# Altium schematic sheet Sheet1.SchDoc
size A3
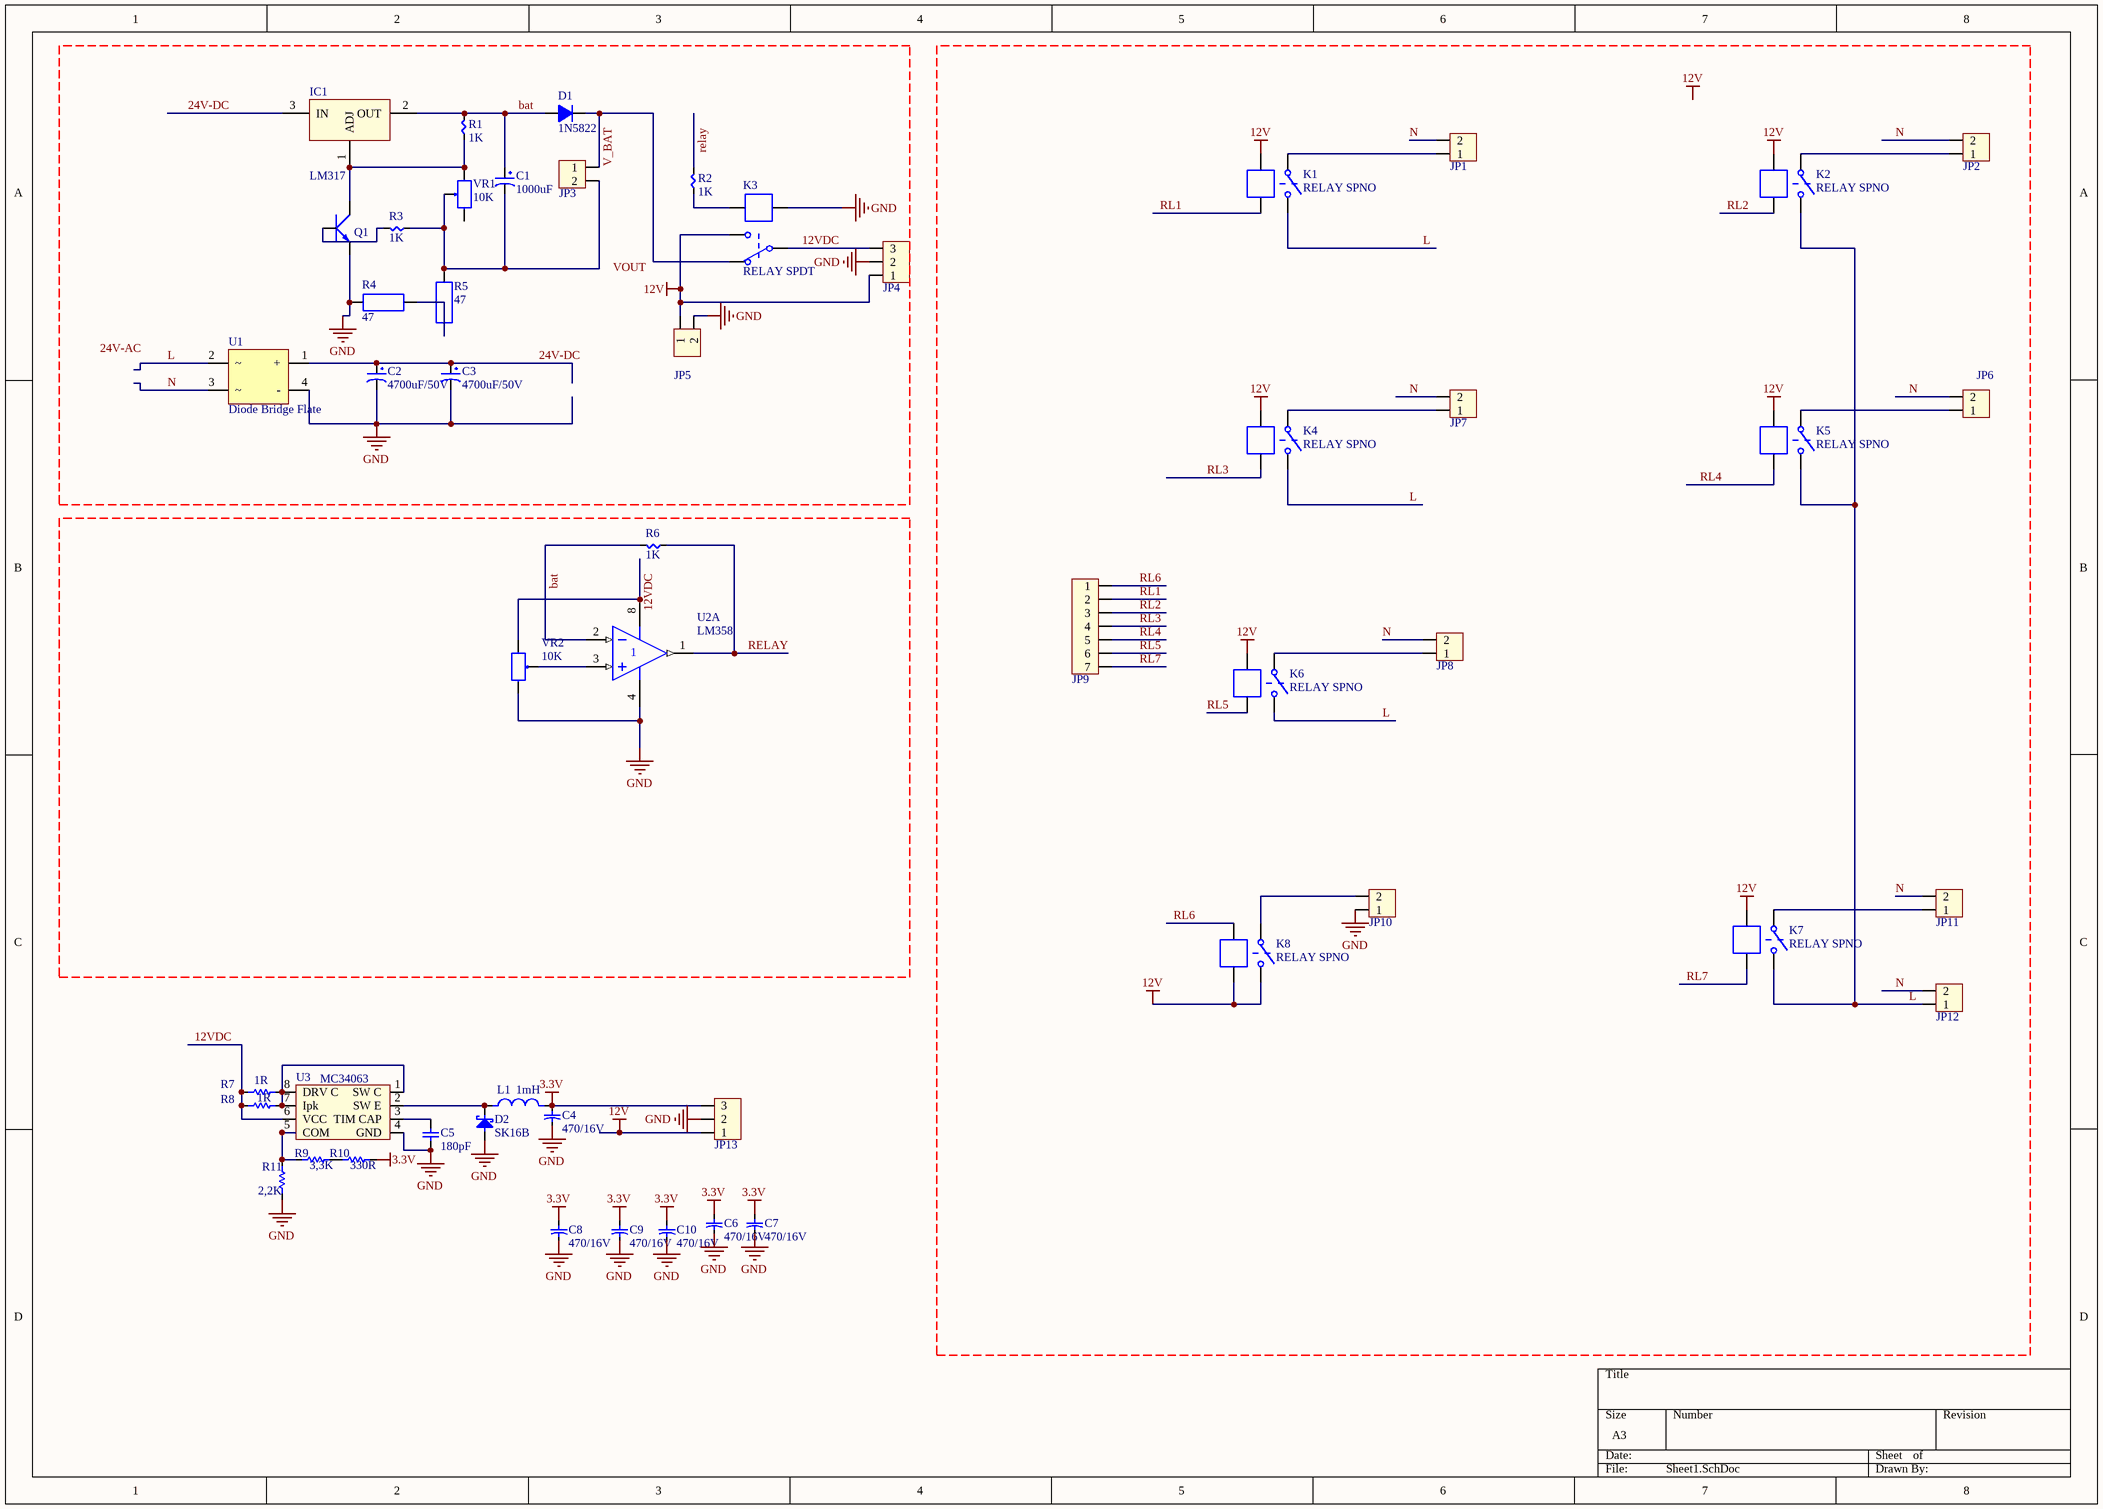
[diagram p0: Sheet1.SchDoc]

## Parts
C1  1000uF  [CP2/4]
C2  4700uF/50V  [CP2/4]
C3  4700uF/50V  [CP2/4]
C4  470/16V  [CAP 470/16V]
C5  180pF  [CAP 0805]
C6  470/16V  [CAP 470/16V]
C7  470/16V  [CAP 470/16V]
C8  470/16V  [CAP 470/16V]
C9  470/16V  [CAP 470/16V]
C10  470/16V  [CAP 470/16V]
D1  1N5822  [D5A]
D2  SK16B  [DIODE]
IC1  LM317  [QTO-220]
JP1  Connector 2  [HED2T]  (value not drawn)
JP2  Connector 2  [HED2T]  (value not drawn)
JP3  Connector 2  [HED2T]  (value not drawn)
JP4  Connector 3  [CON3]  (value not drawn)
JP5  Connector 2  [CON2]  (value not drawn)
JP6  Connector 2  [HED2T]  (value not drawn)
JP7  Connector 2  [HED2T]  (value not drawn)
JP8  Connector 2  [HED2T]  (value not drawn)
JP9  Connector 7  [CON7]  (value not drawn)
JP10  Connector 2  [HED2T]  (value not drawn)
JP11  Connector 2  [HED2T]  (value not drawn)
JP12  Connector 2  [HED2T]  (value not drawn)
JP13  Connector 3  [CON3]  (value not drawn)
K1  RELAY SPNO  [RELAY SONGCHUAN 834]
K2  RELAY SPNO  [RELAY SONGCHUAN 834]
K3  RELAY SPDT  [RELAY SPDT]
K4  RELAY SPNO  [RELAY SONGCHUAN 834]
K5  RELAY SPNO  [RELAY SONGCHUAN 834]
K6  RELAY SPNO  [RELAY SONGCHUAN 834]
K7  RELAY SPNO  [RELAY SONGCHUAN 834]
K8  RELAY SPNO  [RELAY SONGCHUAN 834]
L1  1mH  [INDUCTOR 8*10]
Q1  C9014  [QTO-92]  (value not drawn)
R1  1K  [SM-0805]
R2  1K  [SM-0805]
R3  1K  [SM-0805]
R4  47  [R2W]
R5  47  [R2W]
R6  1K  [SM-0805]
R7  value 1R  [res 1206 top]  (hidden comment: Res)
R8  value 1R  [res 1206 top]  (hidden comment: Res)
R9  value 3,3K  [res 0805 BUT]  (hidden comment: Res)
R10  value 330R  [res 0805 BUT]  (hidden comment: Res)
R11  value 2,2K  [res 0805 BUT]  (hidden comment: Res)
U1  Diode Bridge Flate  [DIODE BRIDGE(FLAT) BIG]
U2  LM358  [SO-8]  (part A of 2)
U3  MC34063  [SOIC 8 NB]
VR1  10K  [VR]
VR2  10K  [VR1]

## Nets
3.3V: C4.1 C6.1 C7.1 C8.1 C9.1 C10.1 JP13.3 L1.2 R10.1
12V: JP4.1 JP5.1 JP13.1 K1.1 K2.1 K3.4 K4.1 K5.1 K6.1 K7.1 K8.2 K8.3
GND: C2.2 C3.2 C4.2 C5.1 C6.2 C7.2 C8.2 C9.2 C10.2 D2.1(A) JP4.2 JP5.2 JP10.1 JP13.2 K3.1 Q1.1(E) R4.1 R11.2 U1.4(-) U2.4(V-) U3.4(GND) VR2.3
12VDC: JP4.3 K3.3 R7.2 R8.2 U2.8(V+) U3.6(VCC) VR2.1
24V-DC: C2.1 C3.1 IC1.3(IN) U1.1(+)
bat: C1.1 D1.1(A) IC1.2(OUT) R1.1 R6.1 U2.2(IN-)
L: JP12.1 K1.3 K2.3 K4.3 K5.3 K6.3 K7.3 U1.2
N: JP1.2 JP2.2 JP6.2 JP7.2 JP8.2 JP11.2 JP12.2 U1.3
relay: R2.1 R6.2 U2.1(OUT)
RL1: JP9.2 K1.2
RL2: JP9.3 K2.2
RL3: JP9.4 K4.2
RL4: JP9.5 K5.2
RL5: JP9.6 K6.2
RL6: JP9.1 K8.1
RL7: JP9.7 K7.2
V_BAT: D1.2(K) JP3.1 K3.5
NetC1_2: C1.2 JP3.2 R3.2 R5.2 VR1.2
NetC5_2: C5.2 U3.3(TIM_CAP)
NetD2_2: D2.2(K) L1.1 U3.2(SW_E)
NetIC1_1: IC1.1(ADJ) Q1.3(C) R1.2 VR1.3
NetJP1_1: JP1.1 K1.4
NetJP2_1: JP2.1 K2.4
NetJP6_1: JP6.1 K5.4
NetJP7_1: JP7.1 K4.4
NetJP8_1: JP8.1 K6.4
NetJP10_2: JP10.2 K8.4
NetJP11_1: JP11.1 K7.4
NetK3_2: K3.2 R2.2
NetQ1_2: Q1.2(B) R3.1
NetR4_2: R4.2 R5.1
NetR7_1: R7.1 R8.1 U3.1(SW_C) U3.7(Ipk) U3.8(DRV_C)
NetR9_1: R9.1 R10.2
NetR9_2: R9.2 R11.1 U3.5(COM)
NetU2_3: U2.3(IN+) VR2.2

Not connected (* = marked no-connect by the designer): VR1 1

## Notes on the sheet
- Labels drawn without touching a wire or pin: 12V, 24V-AC, VOUT

## Library data of the parts
C1 = CP2: C 47uF/50V , 220uF/16V; Value: 47uF/16 - 50V; Description 1: 470uF/6,3V - 330uF/10V - 220uF/16V; Description 2: 100uF/25V - 35V - 47uF/50V - 22uF/100V; Description 3: 33uF => 47uF/63V - 1uF => 4,7uF/160V; Description 4: 1uF => 2,2uF/250V - 1uF/350V
C2 C3 = CP7: Cap 4700uF/50V; Value: 4700uF/50V
C4 C6-C10 = CAP P: Value: 100pF; Published: 23-Sep-2002; PackageReference: CAPR5-4X5; Publisher: Altium Limited
C5 = Cap 1206 BUT: Capacitor; Value: 104; Published: 8-Jun-2000; LatestRevisionDate: 17-Jul-2002; LatestRevisionNote: Re-released for DXP Platform.; PackageReference: RAD-0.3; Publisher: Altium Limited
D1 = D5A: Diode 5A; Value: 1N5408
D2 = DIODE SCHOTTKY: High Conductance Fast Diode; Published: 8-Jun-2000; LatestRevisionDate: 17-Jul-2002; LatestRevisionNote: Re-released for DXP Platform.; DatasheetVersion: 1997; PackageReference: DO-35; Publisher: Altium Limited; Code_JEDEC: DO-204-AH; ComponentLink1Description: Manufacturer Link; ComponentLink1URL: http://www.fairchildsemi.com/; ComponentLink2Description: Datasheet; ComponentLink2URL: http://www.fairchildsemi.com/ds/1N%2F1N4448.pdf
IC1 = LM317: Adj Voltage +1.2 -> +37V; Value: LM317
JP1-JP3 JP5-JP8 JP10-JP12 = CON2: Value: Connector 2
JP4 JP13 = CON3: Value: Connector 3
JP9 = CON7: Value: Connector 7
K1 K2 K4-K8 = RELAY SPNO: SINGLE Pole Dual-Throw Relay; Published: 24-Mar-1999; LatestRevisionDate: 17-Jul-2002; LatestRevisionNote: Re-released for DXP Platform.; PackageReference: DIP-P8; Publisher: Altium Limited; PackageDescription: Relay; 8 Leads
K3 = RELAY SPDT: SINGLE Pole Dual-Throw Relay; Published: 24-Mar-1999; LatestRevisionDate: 17-Jul-2002; LatestRevisionNote: Re-released for DXP Platform.; PackageReference: DIP-P8; Publisher: Altium Limited; PackageDescription: Relay; 8 Leads
L1 = INDUCTOR: Code_IEC: 1005; Value: 10mH; Published: 8-Jun-2000; LatestRevisionDate: 17-Jul-2002; LatestRevisionNote: Re-released for DXP Platform.; PackageReference: 0402-A; Publisher: Altium Limited; Code_JEITA: 0402
Q1 = NPN_EBC: P 600mW, EBC; Value: C9014
R1-R3 R6 = RES 0805 BUT: Resistor
R4 R5 = R2W: Resistor 2W; Value: R2W - 47
R7-R11 = Res: Resistor; Published: 8-Jun-2000; LatestRevisionDate: 17-Jul-2002; LatestRevisionNote: Re-released for DXP Platform.; PackageReference: AXIAL-0.3; Publisher: Altium Limited
U1 = Diode Bridge Flate: Diode Bridge
U2 = LM3358: Dual Operational Amplifier; Published: 15-Apr-2002; LatestRevisionDate: 13-Apr-2006; LatestRevisionNote: IPC-7351 Footprint Added.; DatasheetVersion: Aug-1988; PackageVersion: Jan-1998; PackageReference: D008; Publisher: Altium Limited; PackageDescription: 8-Pin Small Outline Integrated Circuit 1.27 mm Pitch; Code_IPC: SOIC127P600-8; ComponentLink1Description: Manufacturer Link; ComponentLink1URL: http://www.ti.com/; ComponentLink2Description: Datasheet; ComponentLink2URL: http://www-s.ti.com/sc/ds/lm358.pdf
VR1 VR2 = Vr: Var Resistor; Value: VR 10K